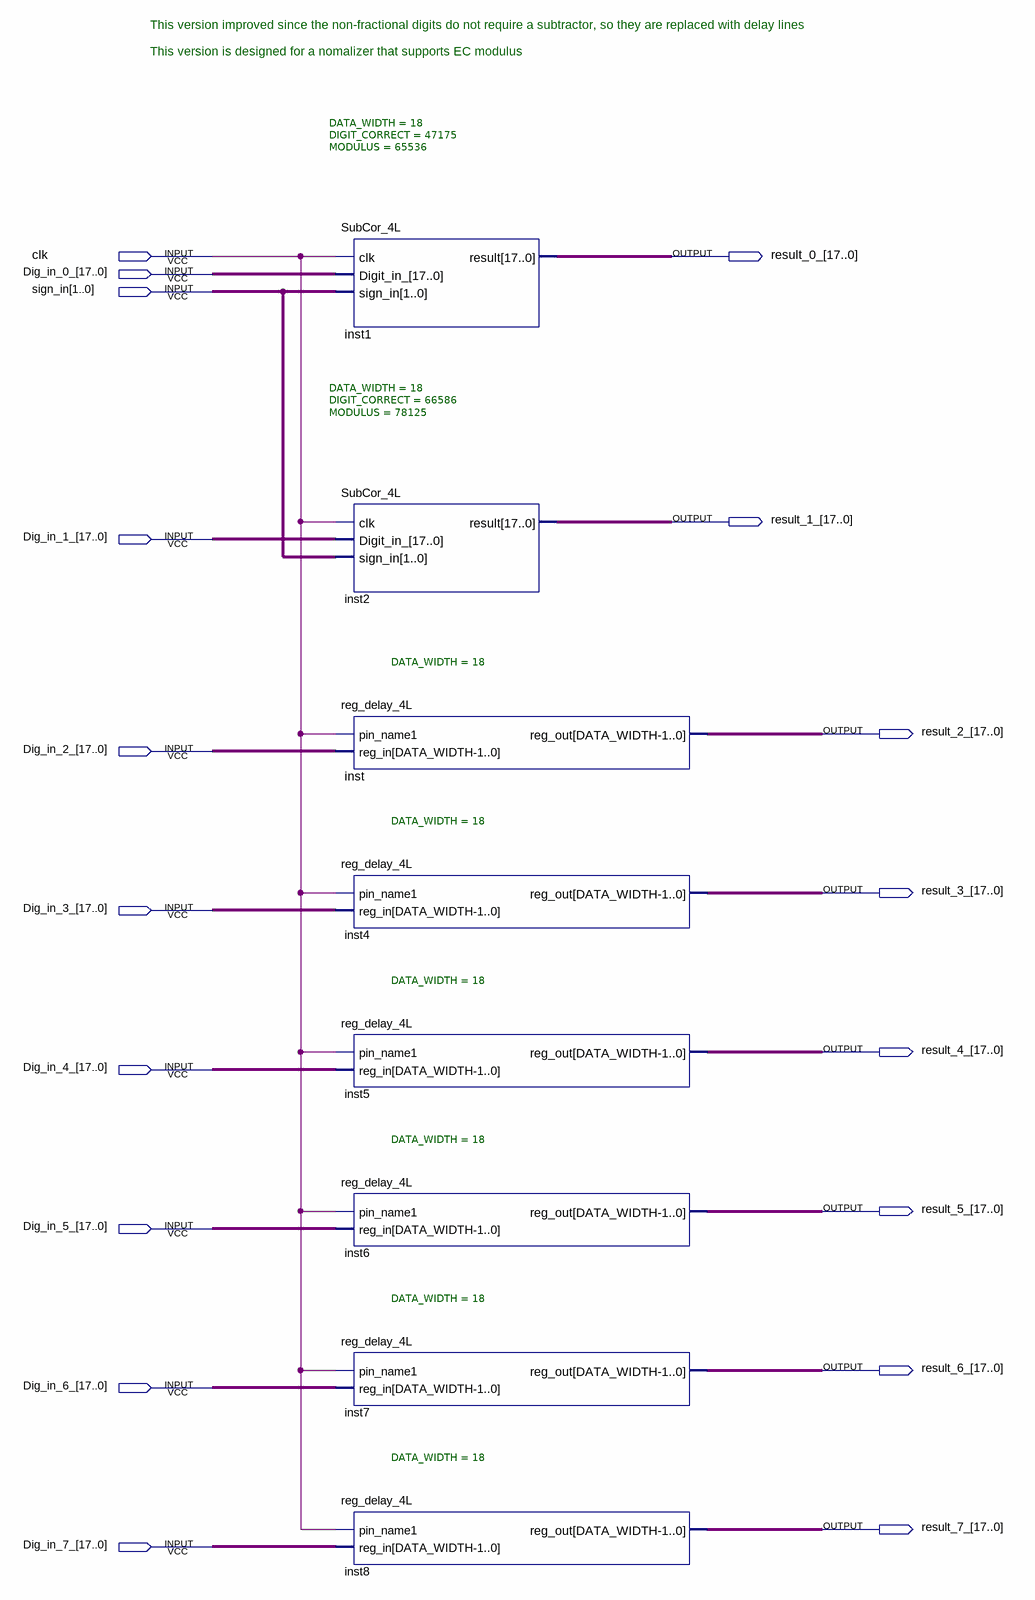
[diagram p0: schematic sheet]
// Quartus schematic SubCorStage_4L_v2.bdf as structural Verilog: 8 symbols, 18 pins
module SubCorStage_4L_v2 (
  input  clk,
  input  [17:0] Dig_in_0_,
  input  [1:0] sign_in,
  input  [17:0] Dig_in_1_,
  input  [17:0] Dig_in_2_,
  input  [17:0] Dig_in_3_,
  input  [17:0] Dig_in_4_,
  input  [17:0] Dig_in_5_,
  input  [17:0] Dig_in_6_,
  input  [17:0] Dig_in_7_,
  output [17:0] result_0_,
  output [17:0] result_1_,
  output [17:0] result_2_,
  output [17:0] result_3_,
  output [17:0] result_4_,
  output [17:0] result_5_,
  output [17:0] result_6_,
  output [17:0] result_7_
);

  SubCor_4L #(.DATA_WIDTH(18), .DIGIT_CORRECT(47175), .MODULUS(65536)) inst1 (
    .clk(clk), .Digit_in_(Dig_in_0_), .sign_in(sign_in), .result(result_0_));
  SubCor_4L #(.DATA_WIDTH(18), .DIGIT_CORRECT(66586), .MODULUS(78125)) inst2 (
    .clk(clk), .Digit_in_(Dig_in_1_), .sign_in(sign_in), .result(result_1_));
  reg_delay_4L #(.DATA_WIDTH(18)) inst (.pin_name1(clk), .reg_in(Dig_in_2_), .reg_out(result_2_));
  reg_delay_4L #(.DATA_WIDTH(18)) inst4 (.pin_name1(clk), .reg_in(Dig_in_3_), .reg_out(result_3_));
  reg_delay_4L #(.DATA_WIDTH(18)) inst5 (.pin_name1(clk), .reg_in(Dig_in_4_), .reg_out(result_4_));
  reg_delay_4L #(.DATA_WIDTH(18)) inst6 (.pin_name1(clk), .reg_in(Dig_in_5_), .reg_out(result_5_));
  reg_delay_4L #(.DATA_WIDTH(18)) inst7 (.pin_name1(clk), .reg_in(Dig_in_6_), .reg_out(result_6_));
  reg_delay_4L #(.DATA_WIDTH(18)) inst8 (.pin_name1(clk), .reg_in(Dig_in_7_), .reg_out(result_7_));

  // Notes on the sheet:
  //   This version improved since the non-fractional digits do not require a subtractor, so they are replaced with delay lines
  //   This version is designed for a nomalizer that supports EC modulus
endmodule
